# Altium project ATMEGA8-ATMEGA16(贴片).PrjPCB
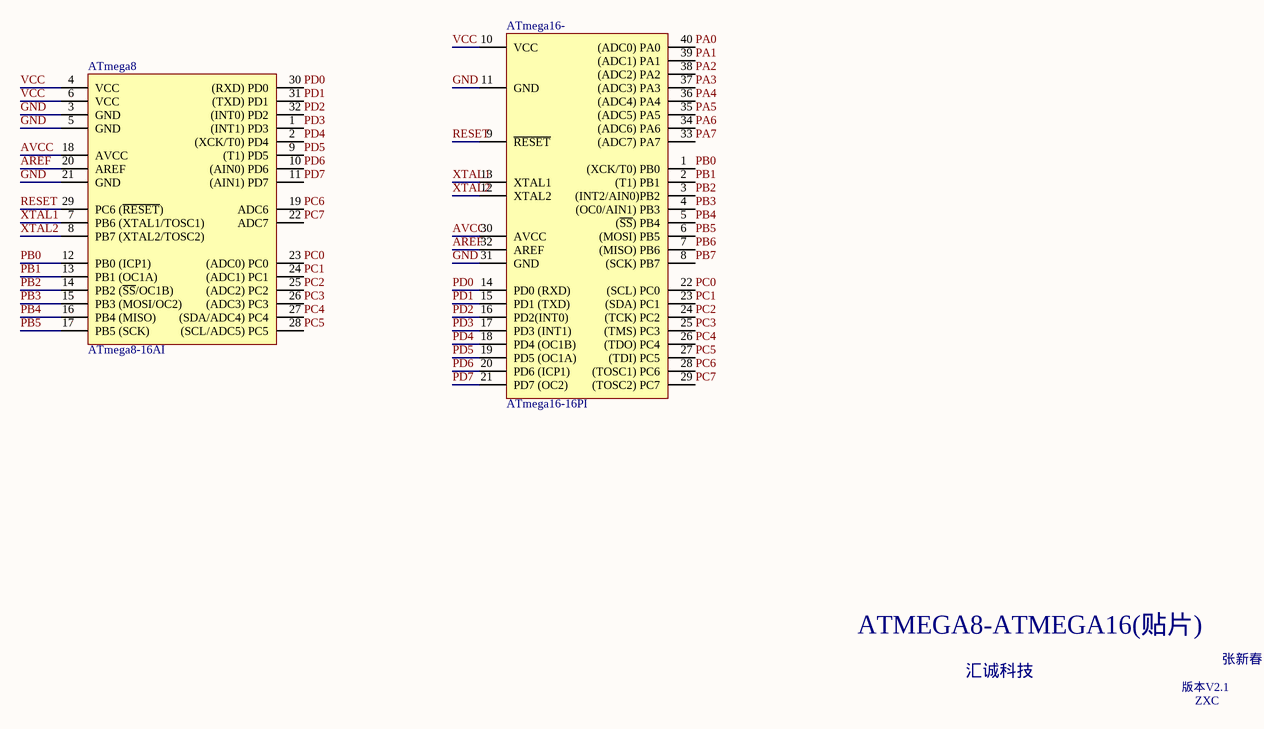
[diagram p0: ATMEGA8-ATMEGA16(贴片).SchDoc]
1 sheet, 2 parts. Net scope: global (net labels, ports and power ports of the same name join across sheets).
Board file: ATMEGA8-ATMEGA16(贴片).PcbDoc

## Sheet ATMEGA8-ATMEGA16(贴片).SchDoc
size A4

### Parts
ATmega8  ATmega8-16AI  [TQFP-32_0.8/7×7mm]
ATmega16-  ATmega16-16PI  [底座DIP-40/引脚15.24mm]

### Nets
AREF: ATmega8.20(AREF) ATmega16-.32(AREF)
AVCC: ATmega8.18(AVCC) ATmega16-.30(AVCC)
GND: ATmega8.3(GND) ATmega8.5(GND) ATmega8.21(GND) ATmega16-.11(GND) ATmega16-.31(GND)
PA0: ATmega16-.40((ADC0)_PA0)
PA1: ATmega16-.39((ADC1)_PA1)
PA2: ATmega16-.38((ADC2)_PA2)
PA3: ATmega16-.37((ADC3)_PA3)
PA4: ATmega16-.36((ADC4)_PA4)
PA5: ATmega16-.35((ADC5)_PA5)
PA6: ATmega16-.34((ADC6)_PA6)
PA7: ATmega16-.33((ADC7)_PA7)
PB0: ATmega8.12(PB0_(ICP1)) ATmega16-.1((XCK/T0)_PB0)
PB1: ATmega8.13(PB1_(OC1A)) ATmega16-.2((T1)_PB1)
PB2: ATmega8.14(PB2_(~{SS}/OC1B)) ATmega16-.3((INT2/AIN0)PB2)
PB3: ATmega8.15(PB3_(MOSI/OC2)) ATmega16-.4((OC0/AIN1)_PB3)
PB4: ATmega8.16(PB4_(MISO)) ATmega16-.5((~{SS})_PB4)
PB5: ATmega8.17(PB5_(SCK)) ATmega16-.6((MOSI)_PB5)
PB6: ATmega16-.7((MISO)_PB6)
PB7: ATmega16-.8((SCK)_PB7)
PC0: ATmega8.23((ADC0)_PC0) ATmega16-.22((SCL)_PC0)
PC1: ATmega8.24((ADC1)_PC1) ATmega16-.23((SDA)_PC1)
PC2: ATmega8.25((ADC2)_PC2) ATmega16-.24((TCK)_PC2)
PC3: ATmega8.26((ADC3)_PC3) ATmega16-.25((TMS)_PC3)
PC4: ATmega8.27((SDA/ADC4)_PC4) ATmega16-.26((TDO)_PC4)
PC5: ATmega8.28((SCL/ADC5)_PC5) ATmega16-.27((TDI)_PC5)
PC6: ATmega8.19(ADC6) ATmega16-.28((TOSC1)_PC6)
PC7: ATmega8.22(ADC7) ATmega16-.29((TOSC2)_PC7)
PD0: ATmega8.30((RXD)_PD0) ATmega16-.14(PD0_(RXD))
PD1: ATmega8.31((TXD)_PD1) ATmega16-.15(PD1_(TXD))
PD2: ATmega8.32((INT0)_PD2) ATmega16-.16(PD2(INT0))
PD3: ATmega8.1((INT1)_PD3) ATmega16-.17(PD3_(INT1))
PD4: ATmega8.2((XCK/T0)_PD4) ATmega16-.18(PD4_(OC1B))
PD5: ATmega8.9((T1)_PD5) ATmega16-.19(PD5_(OC1A))
PD6: ATmega8.10((AIN0)_PD6) ATmega16-.20(PD6_(ICP1))
PD7: ATmega8.11((AIN1)_PD7) ATmega16-.21(PD7_(OC2))
RESET: ATmega8.29(PC6_(~{RESET})) ATmega16-.9(~{RESET})
VCC: ATmega8.4(VCC) ATmega8.6(VCC) ATmega16-.10(VCC)
XTAL1: ATmega8.7(PB6_(XTAL1/TOSC1)) ATmega16-.13(XTAL1)
XTAL2: ATmega8.8(PB7_(XTAL2/TOSC2)) ATmega16-.12(XTAL2)

### Notes on the sheet
- ATMEGA8-ATMEGA16(贴片)
- 汇诚科技
- 版本V2.1
- 张新春
- ZXC

### Library data of the parts
ATmega8 = ATmega8-A: 8 位微处理器/32引脚; 子类别: 微处理器; 发布者: 磊元工作室; 发布日期: 2003年8月18日; 制造商: Atmel Corporation; 类别: 集成电路; 元件名称（国标）: 8 位微处理器; 元件名称（英文）: 8-bit Microcontroller; 特性:存储器容量: Flash：8KB ，EEPROM：512B ，RAM：1KB; 特性:定时器/计数器: 2 个 8-bit ，1 个 16-bit; 特性:模/数转换器: 8 通道 10-bit ADC; 特性:指令: 两个时钟周期的硬件乘法器
ATmega16- = ATmega16-P: 8 位微处理器/40引脚; 子类别: 微处理器; 发布者: 磊元工作室; 发布日期: 2003年8月18日; 制造商: Atmel Corporation; 类别: 集成电路; 元件名称（国标）: 8 位微处理器; 元件名称（英文）: 8-bit Microcontroller; 特性:存储器容量: Flash：16KB ，EEPROM：512B ，RAM：1KB; 特性:定时器/计数器: 2 个 8-bit ，1 个 16-bit; 特性:模/数转换器: 8 通道 10-bit ADC; 特性:指令: 两个时钟周期的硬件乘法器